# EAGLE design Thing_Plus_Qwiic_Shield (EAGLE 9.1.0)
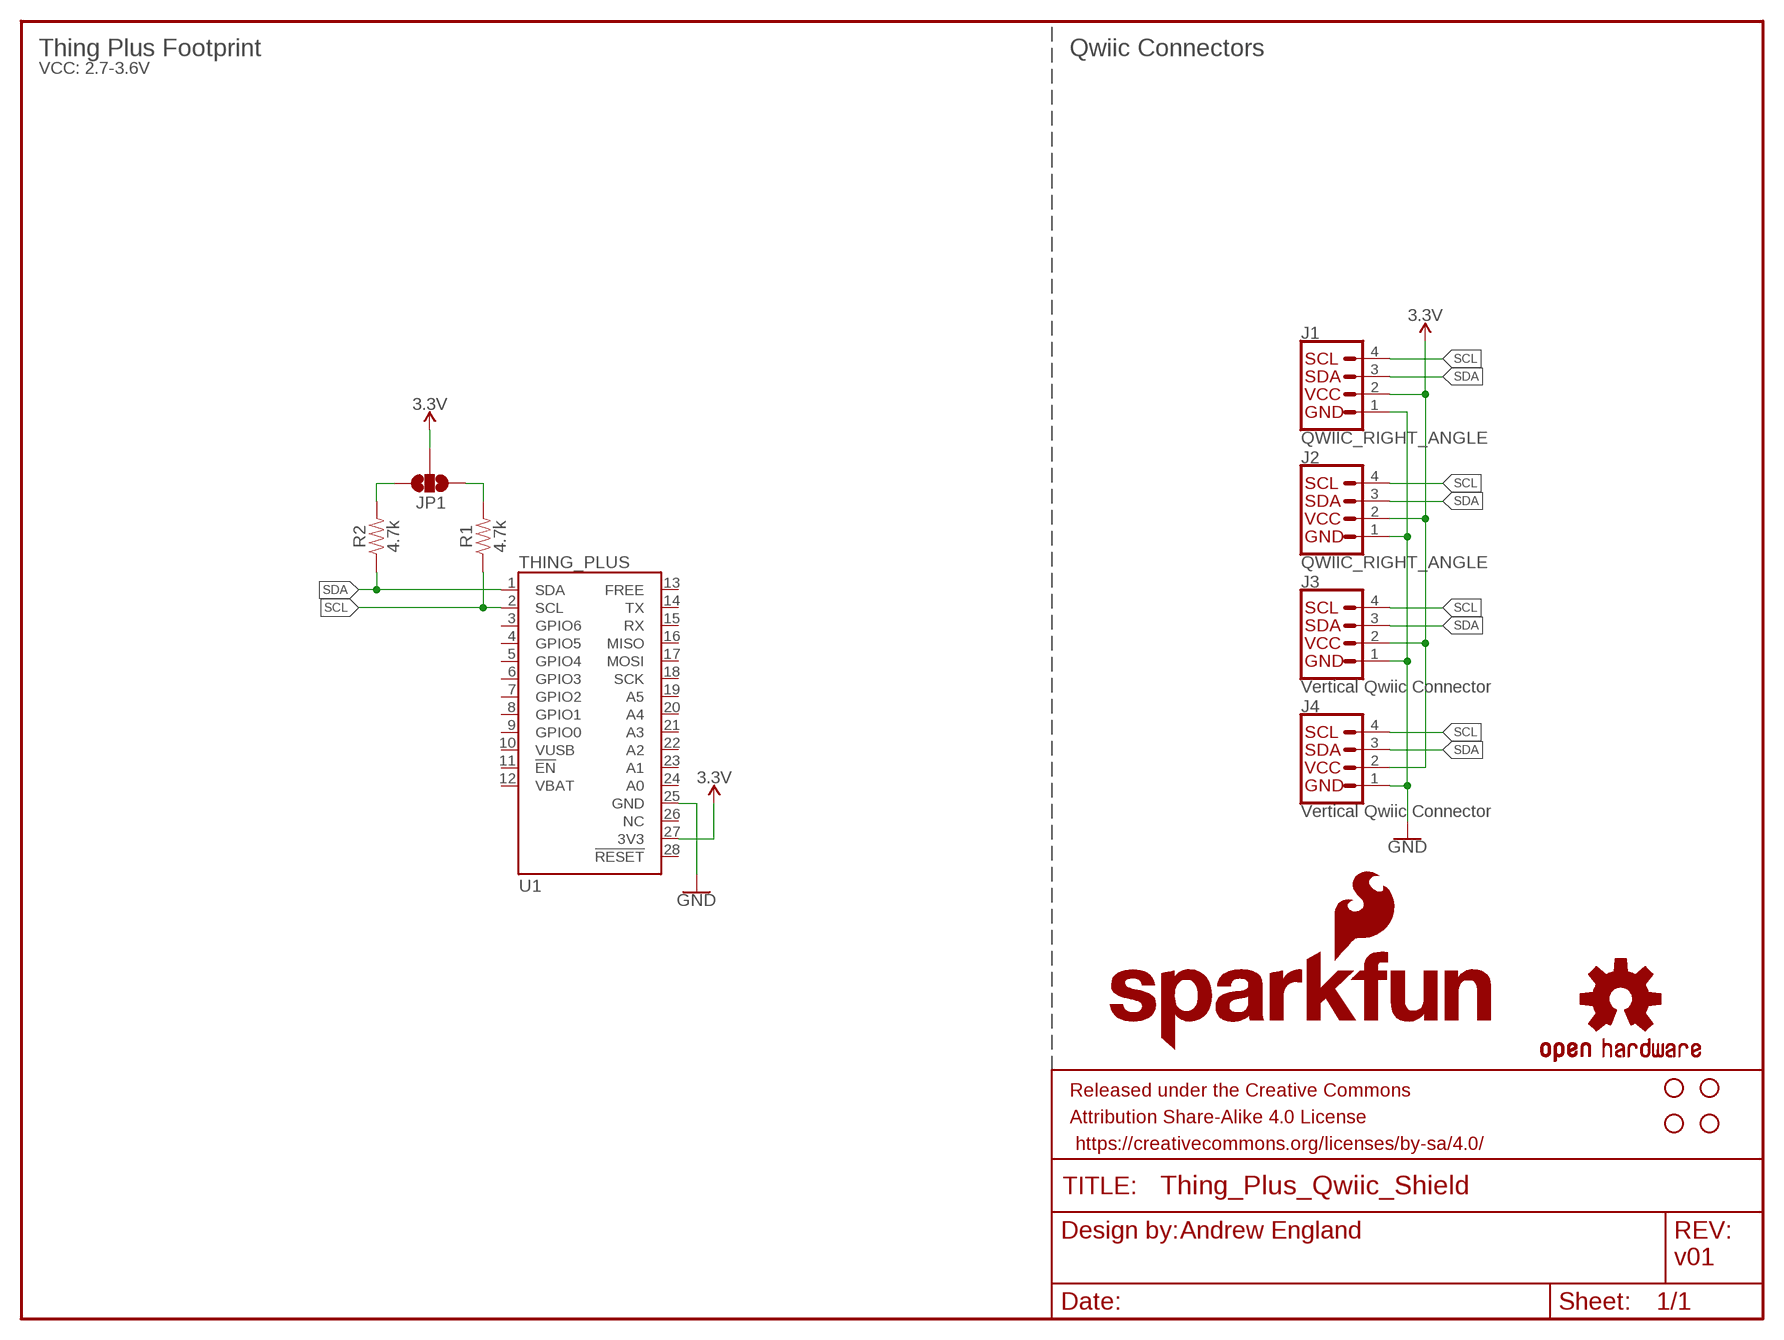
[diagram p0: schematic, sheet 1]

## Parts
FRAME1  FRAME-LETTER  [CREATIVE_COMMONS]
H1  STAND-OFF  [STAND-OFF]
H2  STAND-OFF  [STAND-OFF]
H3  STAND-OFF  [STAND-OFF]
H4  STAND-OFF  [STAND-OFF]
J1  QWIIC_RIGHT_ANGLE  QWIIC_CONNECTORJS-1MM  [JST04_1MM_RA]
J2  QWIIC_RIGHT_ANGLE  QWIIC_CONNECTORJS-1MM  [JST04_1MM_RA]
J3  Vertical Qwiic Connector  QWIIC_CONNECTOR  [JST04_1MM_VERT]
J4  Vertical Qwiic Connector  QWIIC_CONNECTOR  [JST04_1MM_VERT]
JP1  JUMPER-SMT_3_NO_NO-SILK  [SMT-JUMPER_3_NO_NO-SILK]
LOGO1  SFE_LOGO_NAME_FLAME.1_INCH  [SFE_LOGO_NAME_FLAME_.1]
LOGO2  SFE_LOGO_NAME_FLAME.2_INCH  [SFE_LOGO_NAME_FLAME_.2]
LOGO3  OSHW-LOGOS  [OSHW-LOGO-S]
R1  4.7k  4.7KOHM-0603-1/10W-1%  [0603]
R2  4.7k  4.7KOHM-0603-1/10W-1%  [0603]
U1  THING_PLUS  [THING_PLUS]

## Nets
3.3V: J1.2 J2.2 J3.2 J4.2 JP1.2 U1.27(3V3)
GND: J1.1 J2.1 J3.1 J4.1 U1.25(GND)
N$3: JP1.3 R2.2
N$4: JP1.1 R1.2
SCL: J1.4 J2.4 J3.4 J4.4 R1.1 U1.2(SCL)
SDA: J1.3 J2.3 J3.3 J4.3 R2.1 U1.1(SDA)
Unconnected: U1.3(GPIO6) U1.4(GPIO5) U1.5(GPIO4) U1.6(GPIO3) U1.7(GPIO2) U1.8(GPIO1) U1.9(GPIO0) U1.10(VUSB) U1.11(!EN) U1.12(VBAT) U1.13(FREE) U1.14(TX) U1.15(RX) U1.16(MISO) U1.17(MOSI) U1.18(SCK) U1.19(A5) U1.20(A4) U1.21(A3) U1.22(A2) U1.23(A1) U1.24(A0) U1.26(NC) U1.28(!RESET)

## Notes on the sheet
- Thing Plus Footprint | Qwiic Connectors
- VCC: 2.7-3.6V
- Andrew England
- v01

## Library data of the parts
FRAME1 = SparkFun-Aesthetics:FRAME-LETTER: Schematic Frame - Letter Standard 8.5x11 US Letter frame
H1-H4 = SparkFun-Hardware:STAND-OFF: Stand Off Drill holes for mechanically mounting via screws, standoffs, etc. Note: Use the keepout ring to avoid running the screw head into surrounding components. Variant Overviews STAND-OFF - Mechanical footprint for a #4 phillips button head screw. STAND-OFF-TIGHT - Mechanical footprint for a #4 phillips button head screw, Example SparkFun Products Screw - Phillips Head (1/4", 4-40, 10 pack) <https://www.sparkfun.com/products/10453> (PRT-10453) Screw - Phillips Head (1/2", 4-40, 10 pack) <https://www.sparkfun.com/products/10452> (PRT-10452) Screw - Phillips Head (3/4", 4-40, 10 pack) <https://www.sparkfun.com/products/10451> (PRT-10451) Screw - Phillips Head (1", 4-40, 10 pack) <https://www.sparkfun.com/products/10450> (PRT-10450)
J1 J2 = SparkFun-Connectors:QWIIC_CONNECTOR: SparkFun I2C Standard Qwiic Connector An SMD 1mm pitch JST connector makes it easy and quick (get it? Qwiic?) to connect I2C devices to each other. The Qwiic system <http://www.sparkfun.com/qwiic> enables fast and solderless connection between popular platforms and various sensors and actuators. We carry 200mm <https://www.sparkfun.com/products/14204>, 100mm <https://www.sparkfun.com/products/14205>, 50mm <https://www.sparkfun.com/products/14206>, and breadboard friendly <https://www.sparkfun.com/products/14207> Qwiic cables. We also offer 10 pcs strips <https://www.sparkfun.com/products/14323> the SMD connectors.; PROD_ID: CONN-13694
J3 J4 = SparkFun-Connectors:QWIIC_CONNECTOR: SparkFun I2C Standard Qwiic Connector An SMD 1mm pitch JST connector makes it easy and quick (get it? Qwiic?) to connect I2C devices to each other. The Qwiic system <http://www.sparkfun.com/qwiic> enables fast and solderless connection between popular platforms and various sensors and actuators. We carry 200mm <https://www.sparkfun.com/products/14204>, 100mm <https://www.sparkfun.com/products/14205>, 50mm <https://www.sparkfun.com/products/14206>, and breadboard friendly <https://www.sparkfun.com/products/14207> Qwiic cables. We also offer 10 pcs strips <https://www.sparkfun.com/products/14323> the SMD connectors.; PROD_ID: CONN-14483
JP1 = SparkFun-Jumpers:JUMPER-SMT_3_NO: Normally open jumper This jumper has three pads in close proximity to each other. Apply solder to close the connection(s).
LOGO1 LOGO2 = SparkFun-Aesthetics:SFE_LOGO_NAME_FLAME: SparkFun Font Logo w/ Flame This is the SparkFun full logo. The logo on the schematic will always be the same size; the package variant is the height of the flame part of the logo. Default layer for the logo on the board is tSilk.
LOGO3 = SparkFun-Aesthetics:OSHW-LOGO: Open-Source Hardware (OSHW) Logo This logo indicates the piece of hardware it is found on incorporates a OSHW license and/or adheres to the definition of open source hardware found here: http://freedomdefined.org/OSHW
R1 R2 = SparkFun-Resistors:4.7KOHM: 4.7kΩ resistor A resistor is a passive two-terminal electrical component that implements electrical resistance as a circuit element. Resistors act to reduce current flow, and, at the same time, act to lower voltage levels within circuits. - Wikipedia; PROD_ID: RES-07857
U1 = SparkFun-Boards:THING_PLUS

## Board
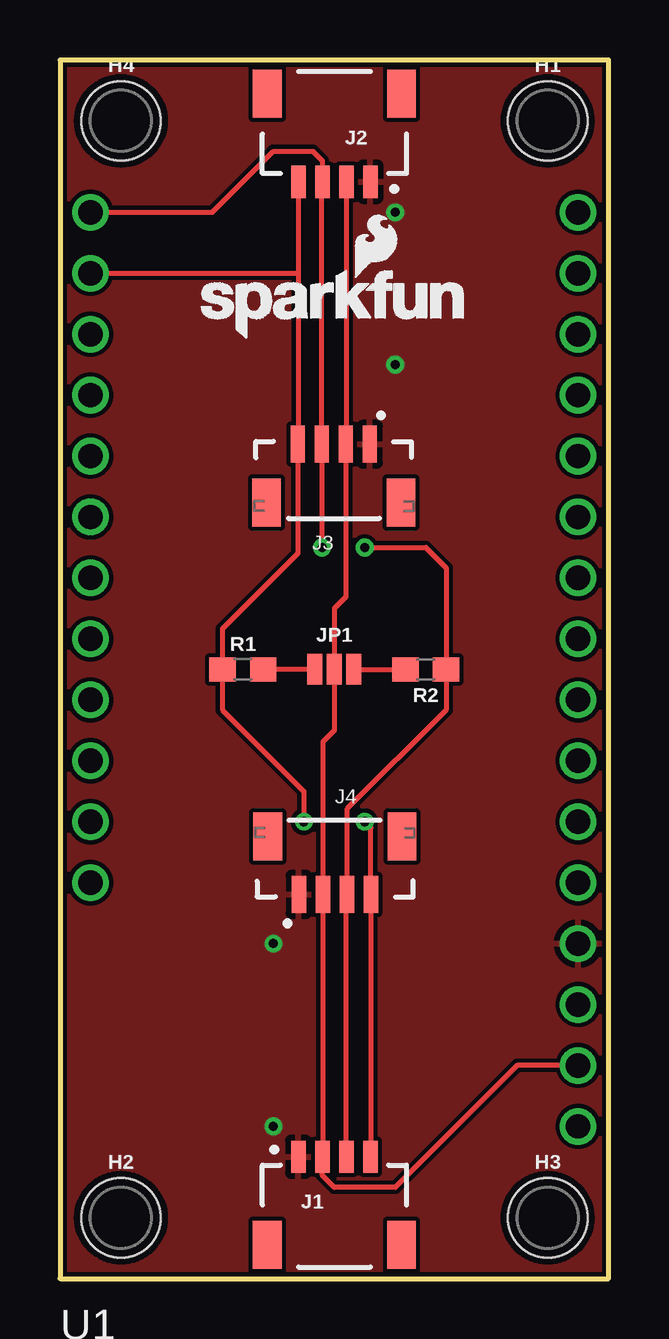
[diagram p1: board, top side]
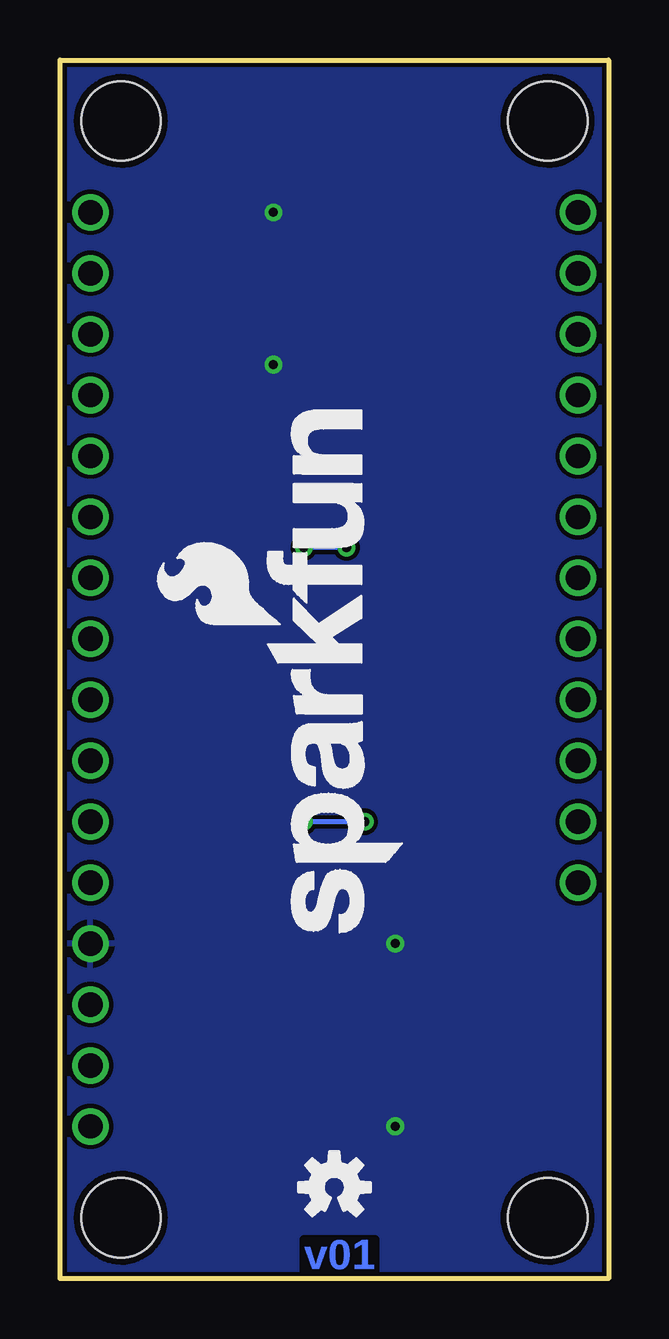
[diagram p2: board, bottom side, seen from below]

Size 22.86 x 50.8 mm. Coordinates in mm from the lower left corner, seen from the top.
Outline: 0,0 22.86,0 22.86,50.8 0,50.8 0,0
Copper layers (1*16): Top 0.035mm / dielectric 1.5mm / Bottom 0.035mm
Design rules "SparkFun-2-layer-TIGHT": minimum track width 7mil, minimum drill 15mil, track to track 7mil, track to pad 7mil, pad to pad 7mil, via to via 7mil, smd to smd 7mil, copper to edge 7mil, drill to drill 7mil, minimum pad ring 7mil, minimum via ring 7mil, stop-mask expansion 4mil, vias tented up to drill 25mil, thermal gap 10mil

### Footprints (pad centres in the part's own frame; a part is rotated, then mirrored left to right if it is on the bottom)
STAND-OFF = hole 3.302: 0,0
JST04_1MM_RA = smd 0.6 x 1.35: 1 -1.5,0; 2 -0.5,0; 3 0.5,0; 4 1.5,0 | smd 1.2 x 2: NC1 2.8,-3.675; NC2 -2.8,-3.675
JST04_1MM_VERT = smd 0.6 x 1.55: 1 -1.478,0.775; 2 -0.478,0.775; 3 0.522,0.775; 4 1.522,0.775 | smd 1.2 x 2: NC1 -2.778,3.2; NC2 2.822,3.2
SMT-JUMPER_3_NO_NO-SILK = smd 0.635 x 1.27: 1 -0.813,0; 2 0,0; 3 0.813,0
0603 = smd 1.1 x 1: 1 -0.85,0; 2 0.85,0
THING_PLUS = drill 1.016: 1 -10.16,19.05; 2 -10.16,16.51; 3 -10.16,13.97; 4 -10.16,11.43; 5 -10.16,8.89; 6 -10.16,6.35; 7 -10.16,3.81; 8 -10.16,1.27; 9 -10.16,-1.27; 10 -10.16,-3.81; 11 -10.16,-6.35; 12 -10.16,-8.89; 13 10.16,19.05; 14 10.16,16.51; 15 10.16,13.97; 16 10.16,11.43; 17 10.16,8.89; 18 10.16,6.35; 19 10.16,3.81; 20 10.16,1.27; 21 10.16,-1.27; 22 10.16,-3.81; 23 10.16,-6.35; 24 10.16,-8.89; 25 10.16,-11.43; 26 10.16,-13.97; 27 10.16,-16.51; 28 10.16,-19.05

### Placement (x,y rotation side)
FRAME1  -11.43,-10.16 0 top  (outside the outline)
H1  20.32,48.26 0 top
H2  2.54,2.54 0 top
H3  20.32,2.54 0 top
H4  2.54,48.26 0 top
J1  11.43,5.08 0 top
J2  11.43,45.72 180 top
J3  11.43,35.56 180 top
J4  11.43,15.24 0 top
JP1  11.43,25.4 0 top
LOGO1  11.43,40.64 0 top
LOGO2  11.43,25.4 90 bottom
LOGO3  11.43,3.81 0 bottom
R1  7.62,25.4 0 top
R2  15.24,25.4 180 top
U1  11.43,25.4 0 top

### Tracks (layer width: path | path; a pad name or v marks a point on that pad's centre or on a via)
3.3V
  Top 0.203: J3.2 11.91,35.56 | 11.91,35.56 11.91,28.42 11.43,27.94 JP1.2 11.43,22.86 10.95,22.38 J4.2 10.95,5.1 J1.2 10.93,4.31 11.43,3.81 13.97,3.81 19.05,8.89 U1.27 | J2.2 11.93,35.58 11.91,35.56
GND  (via drill 0.38)
  other vias: 8.89,13.97 8.89,6.35 13.97,38.1 13.97,44.45
  pour Top: 0,0 22.86,0 22.86,50.8 0,50.8
  pour Bottom: 22.86,0 0,0 0,50.8 22.86,50.8
N$3
  Top 0.203: JP1.3 R2.2
N$4
  Top 0.203: JP1.1 R1.2
SCL  (via drill 0.38)
  Top 0.203: J1.4 12.95,5.1 J4.4 12.95,18.8 v12.7,19.05 | J2.4 9.93,41.91 | U1.2 9.93,41.91 | v10.16,19.05 10.16,20.32 6.77,23.71 R1.1 6.77,27.09 9.91,30.23 J3.4 9.93,34.81 9.93,41.91
  Bottom 0.203: v10.16,19.05 v12.7,19.05
SDA  (via drill 0.38)
  Top 0.203: J1.3 11.93,15.99 J4.3 11.95,19.57 16.09,23.71 R2.1 16.09,29.63 15.24,30.48 v12.7,30.48 | U1.1 6.35,44.45 8.89,46.99 10.54,46.99 10.93,46.6 J2.3 10.91,45.7 J3.3 10.91,30.49 v10.92,30.48
  Bottom 0.203: v10.92,30.48 v12.7,30.48

### Text on the board
Bottom: v01